# Altium schematic sheet Spectacles.SchDoc: Title
size A4; Date: *******; ApprovedBy: *******; CheckedBy: None; Author: *******; CompanyName: *******; DrawnBy: Name; Engineer: *******; Organization: *******; Address1: *******; Address2: *******; Address3: *******; Address4: *******; DocumentNumber: Doc Num; Revision: *******; SheetNumber: 1; SheetTotal: 9; Subtitle: Subtitle; Project: Project; VersionRevision: VersionRevision; TotalSheet: TotalSheet; CurrentTime: *******; CurrentDate: *******; Time: *******; DocumentFullPathAndName: *******; DocumentName: *******; ModifiedDate: *******; ImagePath: *******; ProjectName: *******; Application_BuildNumber: *******
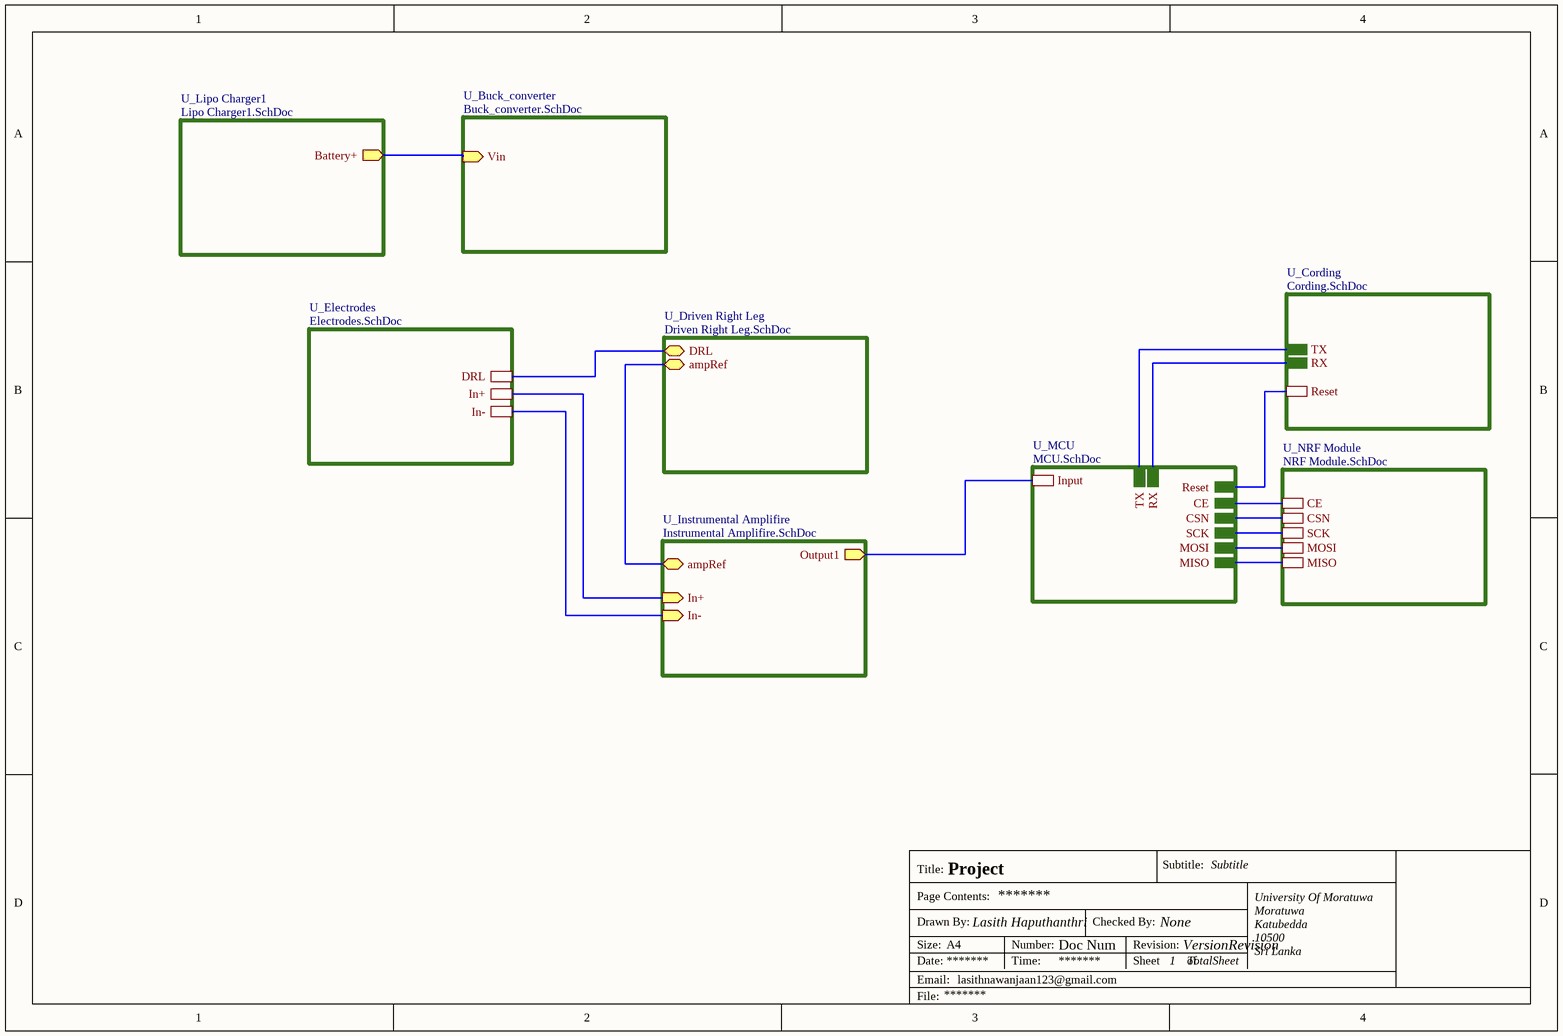
[diagram p0: Spectacles.SchDoc]

## Sub-sheets
U_Buck_converter = Buck_converter.SchDoc: Vin (in)
U_Cording = Cording.SchDoc: Reset, TX, RX
U_Driven Right Leg = Driven Right Leg.SchDoc: DRL (bidir), ampRef (bidir)
U_Electrodes = Electrodes.SchDoc: DRL, In-, In+
U_Instrumental Amplifire = Instrumental Amplifire.SchDoc: In- (in), In+ (in), ampRef (bidir), Output1 (out)
U_Lipo Charger1 = Lipo Charger1.SchDoc: Battery+ (out)
U_MCU = MCU.SchDoc: Input, CE, MOSI, MISO, SCK, CSN, Reset, TX, RX
U_NRF Module = NRF Module.SchDoc: CE, CSN, SCK, MOSI, MISO

## Nets
(unnamed): sheet U_Electrodes/DRL, sheet U_Driven Right Leg/DRL
(unnamed): sheet U_Electrodes/In-, sheet U_Instrumental Amplifire/In-
(unnamed): sheet U_Electrodes/In+, sheet U_Instrumental Amplifire/In+
(unnamed): sheet U_Driven Right Leg/ampRef, sheet U_Instrumental Amplifire/ampRef
(unnamed): sheet U_Instrumental Amplifire/Output1, sheet U_MCU/Input
(unnamed): sheet U_MCU/CE, sheet U_NRF Module/CE
(unnamed): sheet U_MCU/MOSI, sheet U_NRF Module/MOSI
(unnamed): sheet U_MCU/MISO, sheet U_NRF Module/MISO
(unnamed): sheet U_MCU/SCK, sheet U_NRF Module/SCK
(unnamed): sheet U_MCU/CSN, sheet U_NRF Module/CSN
(unnamed): sheet U_MCU/Reset, sheet U_Cording/Reset
(unnamed): sheet U_MCU/TX, sheet U_Cording/TX
(unnamed): sheet U_MCU/RX, sheet U_Cording/RX
(unnamed): sheet U_Lipo Charger1/Battery+, sheet U_Buck_converter/Vin

## Notes on the sheet
- Title:
- Drawn By:
- Page Contents:
- Checked By:
- Subtitle:
- University Of Moratuwa
- Moratuwa
- Size:
- Date:
- File:
- Email:
- A4
- lasithnawanjaan123@gmail.com
- Lasith Haputhanthri
- Number:
- Time:
- Revision:
- Sheet
- of
- Katubedda
- 10500
- Sri Lanka